# EAGLE schematic opengeiger (EAGLE 6.5.0)
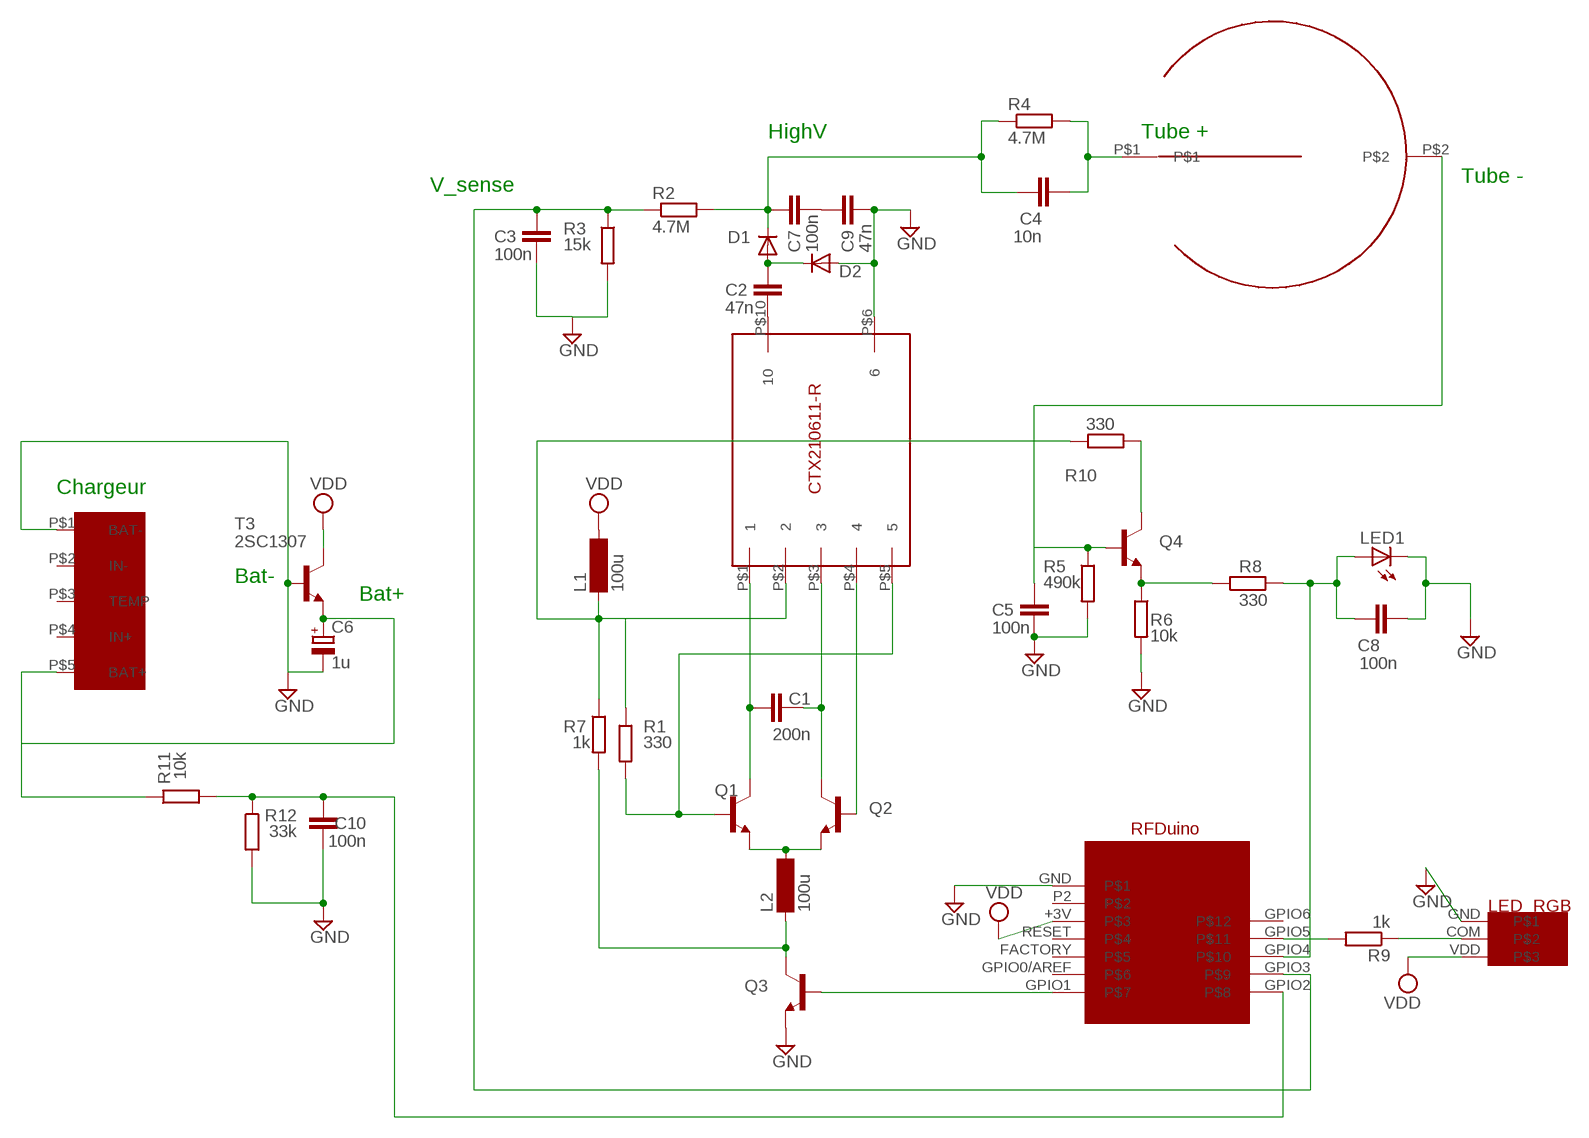
[diagram p0: schematic, sheet 1]

## Parts
C1  200n  C-EU025-024X044  [C025-024X044]
C2  47n  C-EU025-024X044  [C025-024X044]
C3  100n  C-EU025-024X044  [C025-024X044]
C4  10n  C-EU025-024X044  [C025-024X044]
C5  100n  C-EU025-024X044  [C025-024X044]
C6  1u  CPOL-EUE1.8-4  [E1,8-4]
C7  100n  C-EU025-024X044  [C025-024X044]
C8  100n  C-EU025-024X044  [C025-024X044]
C9  47n  C-EU025-024X044  [C025-024X044]
C10  100n  C-EU025-024X044  [C025-024X044]
D1  1N5060GP  [DO15-12]
D2  1N5060GP  [DO15-12]
L1  100u  SD8  [SD8]
L2  100u  SD8  [SD8]
LED1  LEDB155  [Q62902-B155]
Q1  2SC1307  [TO220AV]
Q2  2SC1307  [TO220AV]
Q3  BC238  [TO92]
Q4  BC238  [TO92]
R1  330  R-EU_0204/5  [0204/5]
R2  4.7M  R-EU_0617/17  [0617/17]
R3  15k  R-EU_0204/5  [0204/5]
R4  4.7M  R-EU_0617/17  [0617/17]
R5  490k  R-EU_0204/5  [0204/5]
R6  10k  R-EU_0204/5  [0204/5]
R7  1k  R-EU_0204/5  [0204/5]
R8  330  R-EU_0204/5  [0204/5]
R9  1k  R-EU_0204/5  [0204/5]
R10  330  R-EU_0204/5  [0204/5]
R11  10k  R-EU_0204/5  [0204/5]
R12  33k  R-EU_0204/5  [0204/5]
T3  2SC1307  [TO220AV]
U$1  CCFL_TRANSFO  [CCFL_TRANSFO]
U$2  RFDUINO  [RFDUINO]
U$3  TUBE  [TUBE]
U$4  LED_RBG  [LED_RGB]
U$5  CHARGEUR  [CHARGEUR]

## Nets
GND: C5.2 C9.2 C10.2 D2.A Q3.1(E) R5.2 R12.2 U$1.P$6
N$1: L2.2 Q1.3(E) Q2.3(E)
N$3: C2.1 D1.A D2.C
N$4: Q1.1(B) R1.2 U$1.P$5
N$5: Q3.2(B) U$2.GPIO1
N$6: C1.2 Q2.2(C) U$1.P$3
N$7: R9.1 U$4.COM
N$8: C2.2 U$1.P$10
N$9: Q2.1(B) U$1.P$4
N$10: C7.2 C9.1
N$11: R9.2 U$2.GPIO5
N$12: C4.2 R4.2 U$3.P$1
N$13: Q4.3(C) R10.1
N$14: C5.1 Q4.2(B) R5.1 U$3.P$2
N$15: Q4.1(E) R6.1 R8.1
N$16: C6.+ R11.1 T3.3(E) U$5.P$5(BAT+)
N$17: C10.1 R11.2 R12.1 U$2.GPIO2
N$18: C3.1 R2.1 R3.1 U$2.GPIO3
N$19: C8.1 LED1.A R8.2 U$2.GPIO4
N$20: L2.1 Q3.3(C) R7.2
N$21: C1.1 Q1.2(C) U$1.P$1
N$22: C3.2 C4.1 C6.- C7.1 C8.2 D1.C LED1.K(C) R2.2 R3.2 R4.1 R6.2 T3.1(B) U$2.GND U$4.GND U$5.P$1(BAT-) ; supply symbol labelled GND
N$24: L1.2 T3.2(C) U$2.+3V U$4.VDD ; supply symbol labelled VDD
VDD_BOBINE: L1.1 R1.1 R7.1 R10.2 U$1.P$2
Unconnected: U$2.FACTORY U$2.GPIO0/AREF U$2.GPIO6 U$2.P2 U$2.RESET U$5.P$2(IN-) U$5.P$3(TEMP) U$5.P$4(IN+)

## Notes on the sheet
- HighV | Tube +
- Tube -
- V_sense
- Chargeur
- Bat-
- Bat+

## Library data of the parts
C1-C5 C7-C10 = rcl:C-EU: CAPACITOR, European symbol
C6 = rcl:CPOL-EU: POLARIZED CAPACITOR, European symbol
D1 D2 = diode:1N5060GP: DIODE controlled avalanche rectifier
L1 L2 = inductor-neosid:SD8: INDUCTOR nominal inductance; OC_FARNELL: unknown; OC_NEWARK: unknown
LED1 = led:LED: LED OSRAM: - CHIPLED LG R971, LG N971, LY N971, LG Q971, LY Q971, LO R971, LY R971 LH N974, LH R974 LS Q976, LO Q976, LY Q976 LO Q996 - Hyper CHIPLED LW Q18S LB Q993, LB Q99A, LB R99A - SideLED LS A670, LO A670, LY A670, LG A670, LP A670 LB A673, LV A673, LT A673, LW A673 LH A674 LY A675 LS A676, LA A676, LO A676, LY A676, LW A676 LS A679, LY A679, LG A679 - Hyper Micro SIDELED® LS Y876, LA Y876, LO Y876, LY Y876 LT Y87S - SmartLED LW L88C, LW L88S LB L89C, LB L89S, LG L890 LS L89K, LO L89K, LY L89K LS L896, LA L896, LO L896, LY L896 - TOPLED LS T670, LO T670, LY T670, LG T670, LP T670 LSG T670, LSP T670, LSY T670, LOP T670, LYG T670 LG T671, LOG T671, LSG T671 LB T673, LV T673, LT T673, LW T673 LH T674 LS T676, LA T676, LO T676, LY T676, LB T676, LH T676, LSB T676, LW T676 LB T67C, LV T67C, LT T67C, LS T67K, LO T67K, LY T67K, LW E67C LS E67B, LA E67B, LO E67B, LY E67B, LB E67C, LV E67C, LT E67C LW T67C LS T679, LY T679, LG T679 LS T770, LO T770, LY T770, LG T770, LP T770 LB T773, LV T773, LT T773, LW T773 LH T774 LS E675, LA E675, LY E675, LS T675 LS T776, LA T776, LO T776, LY T776, LB T776 LHGB T686 LT T68C, LB T68C - Hyper Mini TOPLED® LB M676 - Mini TOPLED Santana® LG M470 LS M47K, LO M47K, LY M47K Source: http://www.osram.convergy.de LUXEON: - LUMILED® LXK2-PW12-R00, LXK2-PW12-S00, LXK2-PW14-U00, LXK2-PW14-V00 LXK2-PM12-R00, LXK2-PM12-S00, LXK2-PM14-U00 LXK2-PE12-Q00, LXK2-PE12-R00, LXK2-PE12-S00, LXK2-PE14-T00, LXK2-PE14-U00 LXK2-PB12-K00, LXK2-PB12-L00, LXK2-PB12-M00, LXK2-PB14-N00, LXK2-PB14-P00, LXK2-PB14-Q00 LXK2-PR12-L00, LXK2-PR12-M00, LXK2-PR14-Q00, LXK2-PR14-R00 LXK2-PD12-Q00, LXK2-PD12-R00, LXK2-PD12-S00 LXK2-PH12-R00, LXK2-PH12-S00 LXK2-PL12-P00, LXK2-PL12-Q00, LXK2-PL12-R00 Source: www.luxeon.com KINGBRIGHT: KA-3528ASYC Source: www.kingbright.com
Q1 Q2 T3 = transistor:2SC1307: NPN Transistor Silicon Epitaxial, High Frequency Power Amplifier Source: 2SC1307.pdf
Q3 Q4 = transistor:BC238: NPN TRANSISTOR
R1-R12 = rcl:R-EU_: RESISTOR, European symbol
U$1 = CCFL:CCFL_TRANSFO
U$2 = CCFL:RFDUINO
U$3 = CCFL:TUBE
U$4 = CCFL:LED_RBG
U$5 = CCFL:CHARGEUR